# Altium project LVDS_Adaptor.PrjPcb
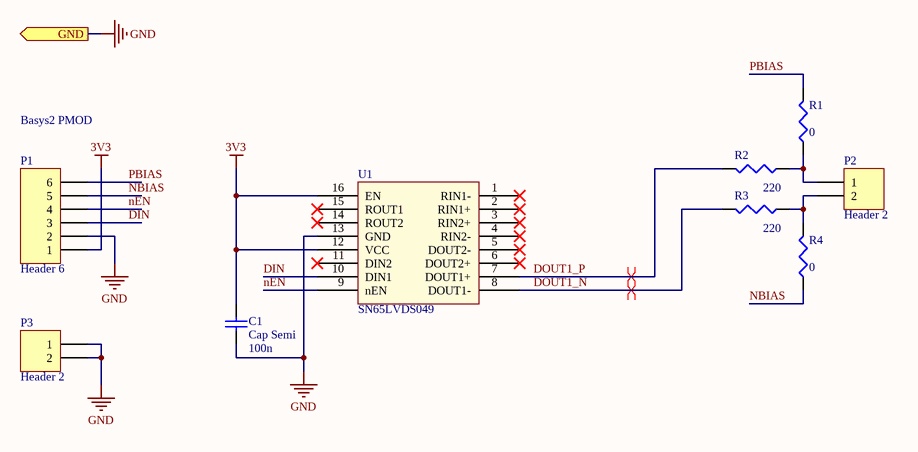
[diagram p0: LVDS_Channel.SchDoc]
1 sheet, 9 parts. Net scope: flat (ports and power ports of the same name join across sheets).
Board files: TwoChipAdapter.PcbDoc, PCB.PcbDoc

## Sheet LVDS_Channel.SchDoc
size A4

### Parts
C1  Cap Semi  value 100n  [1608[0603]]
P1  Header 6  [HDR1X6]
P2  Header 2  [HDR1X2]
P3  Header 2  [HDR1X2]
R1  value 0  [J1-0603]  (hidden comment: Res3)
R2  value 220  [J1-0603]  (hidden comment: Res3)
R3  value 220  [J1-0603]  (hidden comment: Res3)
R4  value 0  [J1-0603]  (hidden comment: Res3)
U1  SN65LVDS049  [SOP127P600-8N]

### Ports
GND (out)

### Nets
3V3: C1.2 P1.1 U1.12(VCC) U1.16(EN)
GND: C1.1 P1.2 P3.1 P3.2 U1.13(GND) ; port GND
DIN: P1.3 U1.10(DIN1)
DOUT1_N: R3.2 U1.8(DOUT1-)
DOUT1_P: R2.2 U1.7(DOUT1+)
NBIAS: P1.5 R4.1
nEN: P1.4 U1.9(nEN)
PBIAS: P1.6 R1.2
NetP2_1: P2.1 R1.1 R2.1
NetP2_2: P2.2 R3.1 R4.2

Not connected (* = marked no-connect by the designer): U1 1(RIN1-)* 2(RIN1+)* 3(RIN2+)* 4(RIN2-)* 5(DOUT2-)* 6(DOUT2+)* 11(DIN2)* 14(ROUT2)* 15(ROUT1)*

### Layout directives
differential pair: DOUT1_N, DOUT1_P

### Notes on the sheet
- Basys2 PMOD

### Library data of the parts
C1 = Cap Semi: Capacitor (Semiconductor SIM Model); Published: 8-Jun-2000; LatestRevisionDate: 29-May-2009; LatestRevisionNote: IPC-7351 Footprint Added.; PackageReference: C1206; Publisher: Altium Limited; PackageDescription: Chip Capacitor
P1 = Header 6: Header, 6-Pin; LatestRevisionDate: 17-Jul-2002; LatestRevisionNote: Re-released for DXP Platform.; Publisher: Altium Limited
P2 P3 = Header 2: Header, 2-Pin; LatestRevisionDate: 17-Jul-2002; LatestRevisionNote: Re-released for DXP Platform.; Publisher: Altium Limited
R1-R4 = Res3: Resistor; Published: 8-Jun-2000; LatestRevisionDate: 29-May-2009; LatestRevisionNote: IPC-7351 Footprint Added.; PackageReference: J1-0603; Publisher: Altium Limited; PackageDescription: Chip Resistor